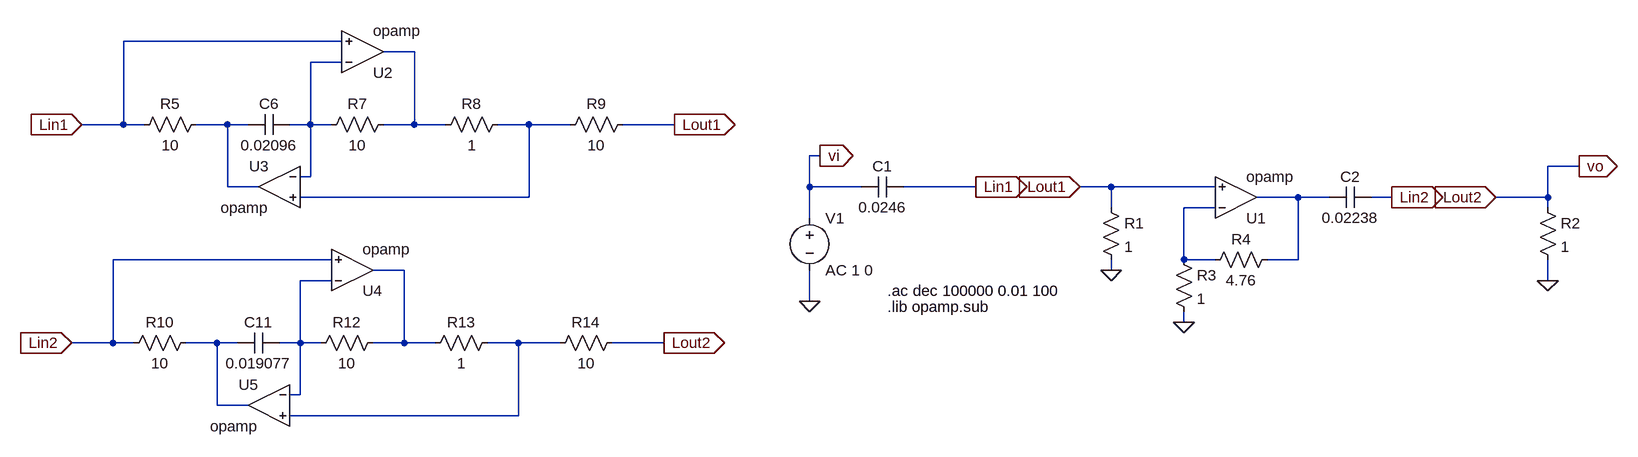
[diagram p0: schematic 20240513_Ejercicio1_d.asc]
20240513_Ejercicio1_d.asc, the LTspice schematic file:
Version 4
SHEET 1 1800 1076
WIRE -608 448 -944 448
WIRE -496 464 -544 464
WIRE -608 480 -656 480
WIRE -944 576 -944 448
WIRE -944 576 -1008 576
WIRE -912 576 -944 576
WIRE -784 576 -832 576
WIRE -752 576 -784 576
WIRE -656 576 -656 480
WIRE -656 576 -688 576
WIRE -624 576 -656 576
WIRE -496 576 -496 464
WIRE -496 576 -544 576
WIRE -448 576 -496 576
WIRE -320 576 -368 576
WIRE -256 576 -320 576
WIRE -96 576 -176 576
WIRE 128 624 112 624
WIRE 1296 640 1248 640
WIRE -656 656 -656 576
WIRE -656 656 -672 656
WIRE -784 672 -784 576
WIRE -736 672 -784 672
WIRE 112 672 112 624
WIRE 192 672 112 672
WIRE 368 672 256 672
WIRE 576 672 528 672
WIRE 736 672 576 672
WIRE -320 688 -320 576
WIRE -320 688 -672 688
WIRE 864 688 800 688
WIRE 912 688 864 688
WIRE 1008 688 976 688
WIRE 1248 688 1248 640
WIRE 1248 688 1168 688
WIRE 576 704 576 672
WIRE 736 704 688 704
WIRE 1248 704 1248 688
WIRE 112 720 112 672
WIRE -624 784 -960 784
WIRE 688 784 688 704
WIRE 736 784 688 784
WIRE 864 784 864 688
WIRE 864 784 816 784
WIRE -512 800 -560 800
WIRE 576 800 576 784
WIRE -624 816 -672 816
WIRE 1248 816 1248 784
WIRE 112 848 112 800
WIRE 688 880 688 864
WIRE -960 912 -960 784
WIRE -960 912 -1024 912
WIRE -928 912 -960 912
WIRE -800 912 -848 912
WIRE -768 912 -800 912
WIRE -672 912 -672 816
WIRE -672 912 -704 912
WIRE -640 912 -672 912
WIRE -512 912 -512 800
WIRE -512 912 -560 912
WIRE -464 912 -512 912
WIRE -336 912 -384 912
WIRE -272 912 -336 912
WIRE -112 912 -192 912
WIRE -672 992 -672 912
WIRE -672 992 -688 992
WIRE -800 1008 -800 912
WIRE -752 1008 -800 1008
WIRE -336 1024 -336 912
WIRE -336 1024 -688 1024
FLAG 112 848 0
FLAG 576 800 0
FLAG 1248 816 0
FLAG 688 880 0
FLAG -1008 576 Lin1
IOPIN -1008 576 In
FLAG -96 576 Lout1
IOPIN -96 576 Out
FLAG 1168 688 Lout2
IOPIN 1168 688 In
FLAG 1008 688 Lin2
IOPIN 1008 688 Out
FLAG 368 672 Lin1
IOPIN 368 672 Out
FLAG 528 672 Lout1
IOPIN 528 672 In
FLAG -1024 912 Lin2
IOPIN -1024 912 In
FLAG -112 912 Lout2
IOPIN -112 912 Out
FLAG 1296 640 vo
IOPIN 1296 640 Out
FLAG 128 624 vi
IOPIN 128 624 Out
SYMBOL cap 256 656 R90
WINDOW 0 0 32 VBottom 2
WINDOW 3 32 32 VTop 2
SYMATTR InstName C1
SYMATTR Value 0.0246
SYMBOL voltage 112 704 R0
SYMATTR InstName V1
SYMATTR Value AC 1 0
SYMBOL res 560 688 R0
SYMATTR InstName R1
SYMATTR Value 1
SYMBOL cap 976 672 R90
WINDOW 0 0 32 VBottom 2
WINDOW 3 32 32 VTop 2
SYMATTR InstName C2
SYMATTR Value 0.02238
SYMBOL res 1232 688 R0
SYMATTR InstName R2
SYMATTR Value 1
SYMBOL OpAmps\\opamp 768 752 M180
SYMATTR InstName U1
SYMBOL res 672 768 R0
SYMATTR InstName R3
SYMATTR Value 1
SYMBOL res 832 768 R90
WINDOW 0 0 56 VBottom 2
WINDOW 3 32 56 VTop 2
SYMATTR InstName R4
SYMATTR Value 4.76
SYMBOL OpAmps\\opamp -576 528 M180
SYMATTR InstName U2
SYMBOL OpAmps\\opamp -704 608 M0
SYMATTR InstName U3
SYMBOL res -816 560 R90
WINDOW 0 0 56 VBottom 2
WINDOW 3 32 56 VTop 2
SYMATTR InstName R5
SYMATTR Value 10
SYMBOL res -528 560 R90
WINDOW 0 0 56 VBottom 2
WINDOW 3 32 56 VTop 2
SYMATTR InstName R7
SYMATTR Value 10
SYMBOL res -352 560 R90
WINDOW 0 0 56 VBottom 2
WINDOW 3 32 56 VTop 2
SYMATTR InstName R8
SYMATTR Value 1
SYMBOL res -160 560 R90
WINDOW 0 0 56 VBottom 2
WINDOW 3 32 56 VTop 2
SYMATTR InstName R9
SYMATTR Value 10
SYMBOL cap -688 560 R90
WINDOW 0 0 32 VBottom 2
WINDOW 3 32 32 VTop 2
SYMATTR InstName C6
SYMATTR Value 0.02096
SYMBOL OpAmps\\opamp -592 864 M180
SYMATTR InstName U4
SYMBOL OpAmps\\opamp -720 944 M0
SYMATTR InstName U5
SYMBOL res -832 896 R90
WINDOW 0 0 56 VBottom 2
WINDOW 3 32 56 VTop 2
SYMATTR InstName R10
SYMATTR Value 10
SYMBOL res -544 896 R90
WINDOW 0 0 56 VBottom 2
WINDOW 3 32 56 VTop 2
SYMATTR InstName R12
SYMATTR Value 10
SYMBOL res -368 896 R90
WINDOW 0 0 56 VBottom 2
WINDOW 3 32 56 VTop 2
SYMATTR InstName R13
SYMATTR Value 1
SYMBOL res -176 896 R90
WINDOW 0 0 56 VBottom 2
WINDOW 3 32 56 VTop 2
SYMATTR InstName R14
SYMATTR Value 10
SYMBOL cap -704 896 R90
WINDOW 0 0 32 VBottom 2
WINDOW 3 32 32 VTop 2
SYMATTR InstName C11
SYMATTR Value 0.019077
TEXT 232 832 Left 2 !.ac dec 100000 0.01 100
TEXT 232 856 Left 2 !.lib opamp.sub

The netlist it stands for:
* 20240513_Ejercicio1_d.asc
C1 Lin1 vi 0.0246
V1 vi 0 AC 1 0
R1 Lout1 0 1
C2 Lin2 N005 0.02238
R2 vo 0 1
XU1 N006 Lout1 N005 opamp Aol=100K GBW=10Meg  ; pins invin noninvin out
R3 N006 0 1
R4 N005 N006 4.76
XU2 N002 Lin1 N001 opamp Aol=100K GBW=10Meg  ; pins invin noninvin out
XU3 N002 N004 N003 opamp Aol=100K GBW=10Meg  ; pins invin noninvin out
R5 N003 Lin1 10
R7 N001 N002 10
R8 N004 N001 1
R9 Lout1 N004 10
C6 N002 N003 0.02096
XU4 N008 Lin2 N007 opamp Aol=100K GBW=10Meg  ; pins invin noninvin out
XU5 N008 N010 N009 opamp Aol=100K GBW=10Meg  ; pins invin noninvin out
R10 N009 Lin2 10
R12 N007 N008 10
R13 N010 N007 1
R14 vo N010 10
C11 N008 N009 0.019077
.ac dec 100000 0.01 100
.lib opamp.sub
.backanno
.end